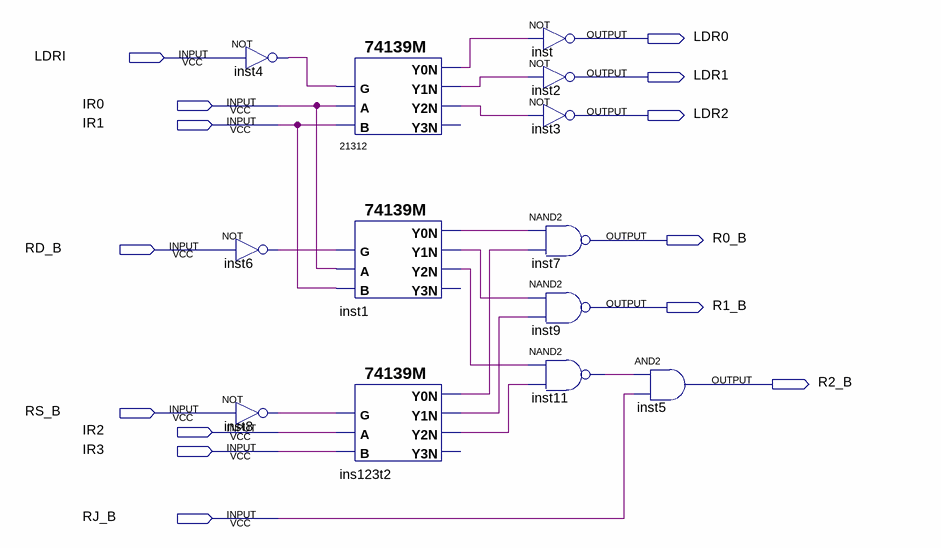
[diagram p0: schematic sheet]
// Quartus schematic LDR0_2.bdf as structural Verilog: 13 symbols, 14 pins
module LDR0_2 (
  input  LDRI,
  input  IR0,
  input  IR1,
  input  RD_B,
  input  RS_B,
  input  IR2,
  input  IR3,
  input  RJ_B,
  output LDR0,
  output LDR1,
  output LDR2,
  output R0_B,
  output R1_B,
  output R2_B
);

  wire ins123t2_y0n, ins123t2_y1n, ins123t2_y2n, inst1_y0n, inst1_y1n, inst1_y2n, inst4_out, inst6_out,
       inst8_out, inst11_out, n21312_y0n, n21312_y1n, n21312_y2n;

  not inst4 (inst4_out, LDRI);
  not inst6 (inst6_out, RD_B);
  not inst8 (inst8_out, RS_B);
  \74139M  u_21312 (
    .B(IR1), .A(IR0), .G(inst4_out), .Y2N(n21312_y2n), .Y0N(n21312_y0n), .Y1N(n21312_y1n));  // open: Y3N
  \74139M  inst1 (.B(IR1), .A(IR0), .G(inst6_out), .Y2N(inst1_y2n), .Y0N(inst1_y0n), .Y1N(inst1_y1n));  // open: Y3N
  \74139M  ins123t2 (
    .B(IR3), .A(IR2), .G(inst8_out), .Y2N(ins123t2_y2n), .Y0N(ins123t2_y0n), .Y1N(ins123t2_y1n));  // open: Y3N
  not inst (LDR0, n21312_y0n);
  not inst2 (LDR1, n21312_y1n);
  not inst3 (LDR2, n21312_y2n);
  nand inst7 (R0_B, inst1_y0n, ins123t2_y0n);
  nand inst9 (R1_B, inst1_y1n, ins123t2_y1n);
  nand inst11 (inst11_out, inst1_y2n, ins123t2_y2n);
  and inst5 (R2_B, inst11_out, RJ_B);
endmodule
